# Altium schematic sheet RS232.SchDoc
size 420 x 297 mm; Revision: 1.1.0; SheetNumber: 11; SheetTotal: 15
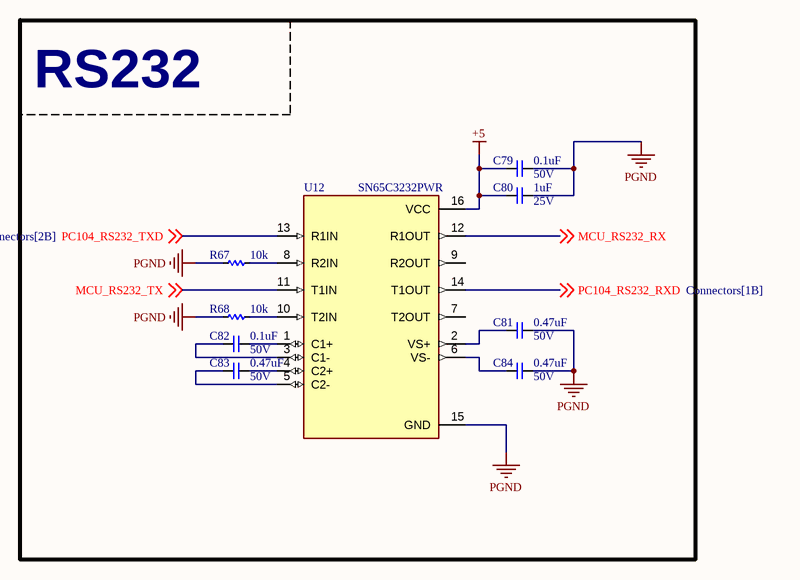
[diagram p0: RS232.SchDoc]

## Parts
C79  0.1uF  Voltage: 50V  [CAP_C_1608X80]
C80  1uF  Voltage: 25V  [CAP_C_1608X80]
C81  0.47uF  Voltage: 50V  [CAP_C_1608X80]
C82  0.1uF  Voltage: 50V  [CAP_C_1608X80]
C83  0.47uF  Voltage: 50V  [CAP_C_1608X80]
C84  0.47uF  Voltage: 50V  [CAP_C_1608X80]
R67  10k  [RES_C_1608X60]
R68  10k  [RES_C_1608X60]
U12  SN65C3232PWR  [TSSOP-16]

## Blocks framed on the sheet
RS232: C79-C84 R67 R68 U12

## Nets
+5: C79.2 C80.2 U12.16(VCC)
PGND: C79.1 C80.1 C81.1 C84.1 R67.1 R68.1 U12.15(GND)
MCU_RS232_RX: U12.12(R1OUT) ; off-sheet MCU_RS232_RX
MCU_RS232_TX: U12.11(T1IN) ; off-sheet MCU_RS232_TX
PC104_RS232_RXD: U12.14(T1OUT) ; off-sheet PC104_RS232_RXD
PC104_RS232_TXD: U12.13(R1IN) ; off-sheet PC104_RS232_TXD
NetC81_2: C81.2 U12.2(VS+)
NetC82_1: C82.1 U12.1(C1+)
NetC82_2: C82.2 U12.3(C1-)
NetC83_1: C83.1 U12.4(C2+)
NetC83_2: C83.2 U12.5(C2-)
NetC84_2: C84.2 U12.6(VS-)
NetR67_2: R67.2 U12.8(R2IN)
NetR68_2: R68.2 U12.10(T2IN)

Not connected (* = marked no-connect by the designer): U12 7(T2OUT) 9(R2OUT)

## Notes on the sheet
- Project:
- DAL_PDU
- Sub-system:
- IGRVT-50
- Design by:
- KIEN HOANG
- BAO BUI
- Sheet title:
- Sheet
- A3
- of
- Checked by:
- Approved by:
- VU PHAM
- Revision:
- Document No:
- Size:
- Date:

## Library data of the parts
C79-C84 = _CAP_C_2: CAP
R67 R68 = _RES_B_2_2: RES